# EAGLE design 16s balancer 3 (EAGLE 7.7.0)
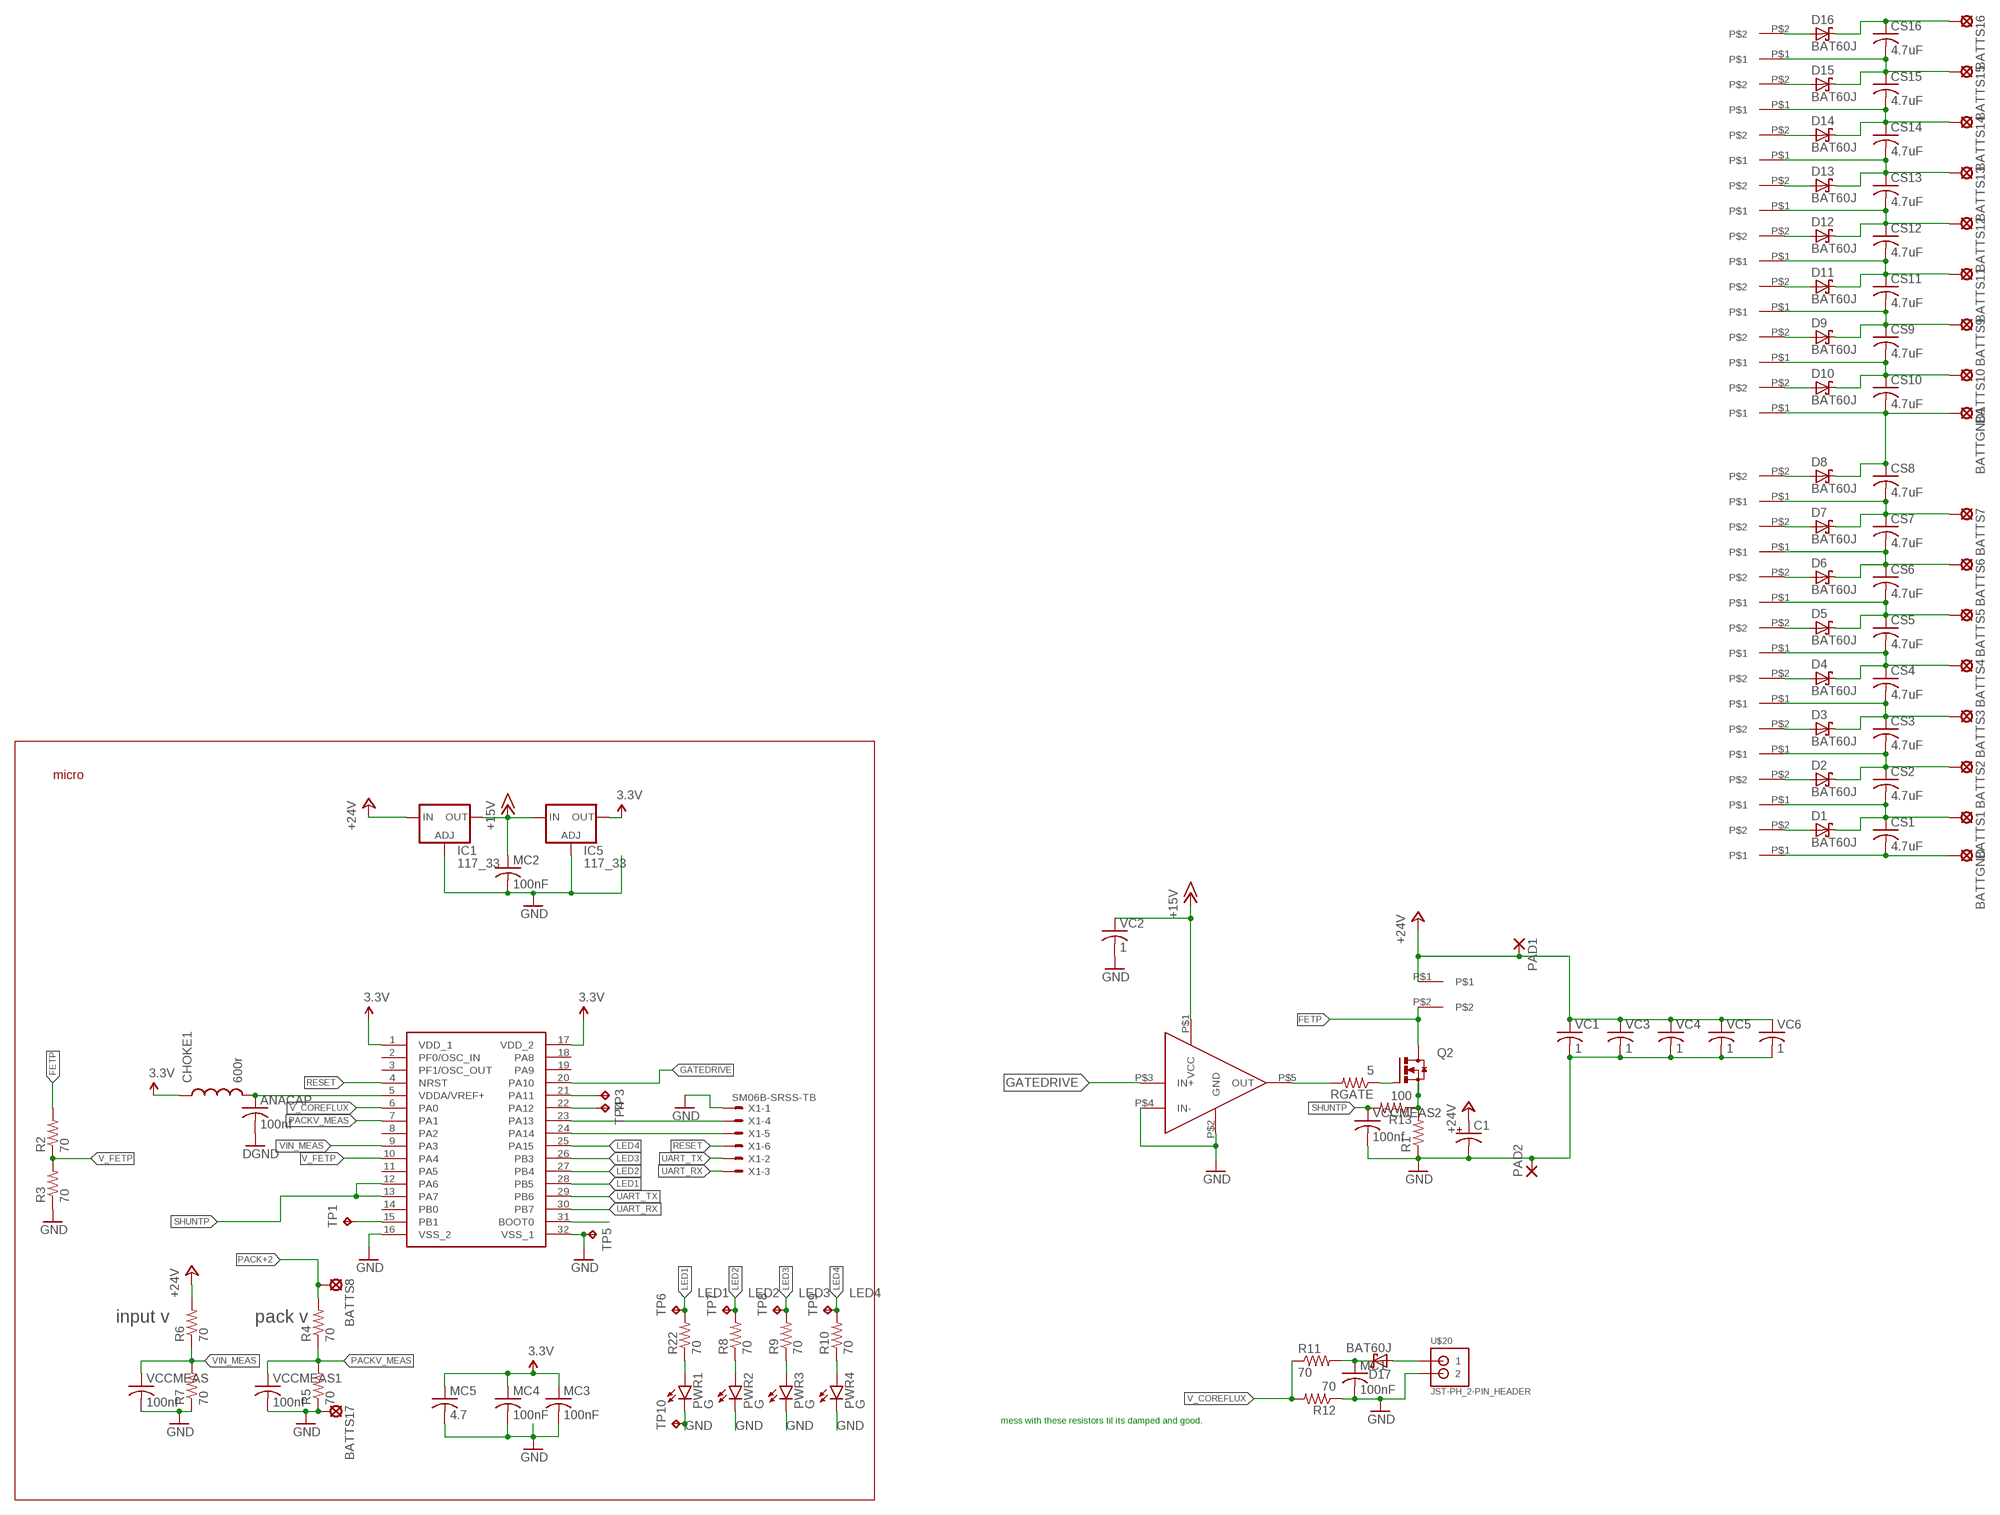
[diagram p0: schematic, sheet 1]

## Parts
ANACAP  100nf  C-USC0603  [C0603]
BATTGND  LSP10  [LSP10]
BATTGND1  LSP10  [LSP10]
BATTS1  LSP10  [LSP10]
BATTS2  LSP10  [LSP10]
BATTS3  LSP10  [LSP10]
BATTS4  LSP10  [LSP10]
BATTS5  LSP10  [LSP10]
BATTS6  LSP10  [LSP10]
BATTS7  LSP10  [LSP10]
BATTS8  LSP10  [LSP10]
BATTS9  LSP10  [LSP10]
BATTS10  LSP10  [LSP10]
BATTS11  LSP10  [LSP10]
BATTS12  LSP10  [LSP10]
BATTS13  LSP10  [LSP10]
BATTS14  LSP10  [LSP10]
BATTS15  LSP10  [LSP10]
BATTS16  LSP10  [LSP10]
BATTS17  LSP10  [LSP10]
C1  CPOL-USE2.5-7  [E2,5-7]
CHOKE1  600r  INDUCTOR0603  [0603]
CS1  4.7uF  C-USC1206  [C1206]
CS2  4.7uF  C-USC1206  [C1206]
CS3  4.7uF  C-USC1206  [C1206]
CS4  4.7uF  C-USC1206  [C1206]
CS5  4.7uF  C-USC1206  [C1206]
CS6  4.7uF  C-USC1206  [C1206]
CS7  4.7uF  C-USC1206  [C1206]
CS8  4.7uF  C-USC1206  [C1206]
CS9  4.7uF  C-USC1206  [C1206]
CS10  4.7uF  C-USC1206  [C1206]
CS11  4.7uF  C-USC1206  [C1206]
CS12  4.7uF  C-USC1206  [C1206]
CS13  4.7uF  C-USC1206  [C1206]
CS14  4.7uF  C-USC1206  [C1206]
CS15  4.7uF  C-USC1206  [C1206]
CS16  4.7uF  C-USC1206  [C1206]
D1  BAT60J  [SOD323_ST]
D2  BAT60J  [SOD323_ST]
D3  BAT60J  [SOD323_ST]
D4  BAT60J  [SOD323_ST]
D5  BAT60J  [SOD323_ST]
D6  BAT60J  [SOD323_ST]
D7  BAT60J  [SOD323_ST]
D8  BAT60J  [SOD323_ST]
D9  BAT60J  [SOD323_ST]
D10  BAT60J  [SOD323_ST]
D11  BAT60J  [SOD323_ST]
D12  BAT60J  [SOD323_ST]
D13  BAT60J  [SOD323_ST]
D14  BAT60J  [SOD323_ST]
D15  BAT60J  [SOD323_ST]
D16  BAT60J  [SOD323_ST]
D17  BAT60J  [SOD323_ST]
IC1  117_33  LD117AS33TR  [SOT223]
IC5  117_33  LD117AS33TR  [SOT223]
MC1  100nF  C-USC0603  [C0603]
MC2  100nF  C-USC0603  [C0603]
MC3  100nF  C-USC0603  [C0603]
MC4  100nF  C-USC0603  [C0603]
MC5  4.7  C-USC0603  [C0603]
PAD1  3,81/1,4  [3,81/1,4]
PAD2  3,81/1,4  [3,81/1,4]
PWR1  G  LED0603  [LED-0603]
PWR2  G  LED0603  [LED-0603]
PWR3  G  LED0603  [LED-0603]
PWR4  G  LED0603  [LED-0603]
Q2  PH7030L  [SOT669]
R1  R-US_R0805  [R0805]
R2  70  R-US_R0603  [R0603]
R3  70  R-US_R0603  [R0603]
R4  70  R-US_R0603  [R0603]
R5  70  R-US_R0603  [R0603]
R6  70  R-US_R0603  [R0603]
R7  70  R-US_R0603  [R0603]
R8  70  R-US_R0603  [R0603]
R9  70  R-US_R0603  [R0603]
R10  70  R-US_R0603  [R0603]
R11  70  R-US_R0603  [R0603]
R12  70  R-US_R0603  [R0603]
R13  100  R-US_R0603  [R0603]
R22  70  R-US_R0603  [R0603]
RGATE  5  R-US_R0603  [R0603]
TP1  TPTP10R  [TP10R]
TP3  TPTP10R  [TP10R]
TP4  TPTP10R  [TP10R]
TP5  TPTP10R  [TP10R]
TP6  TPTP14SQ  [TP14SQ]
TP7  TPTP14SQ  [TP14SQ]
TP8  TPTP14SQ  [TP14SQ]
TP9  TPTP14SQ  [TP14SQ]
TP10  TPTP14SQ  [TP14SQ]
U$1  STM32F303K8  [LQFP32-7X7]
U$2  UCC27517  [SOT-23-5]
U$3  LONG_PADS  [LONG_PADS2]
U$4  LONG_PADS  [LONG_PADS2]
U$5  LONG_PADS  [LONG_PADS2]
U$6  LONG_PADS  [LONG_PADS2]
U$7  LONG_PADS  [LONG_PADS2]
U$8  LONG_PADS  [LONG_PADS2]
U$9  LONG_PADS  [LONG_PADS2]
U$10  LONG_PADS  [LONG_PADS2]
U$11  LONG_PADS  [LONG_PADS2]
U$12  LONG_PADS  [LONG_PADS2]
U$13  LONG_PADS  [LONG_PADS2]
U$14  LONG_PADS  [LONG_PADS2]
U$15  LONG_PADS  [LONG_PADS2]
U$16  LONG_PADS  [LONG_PADS2]
U$17  LONG_PADS  [LONG_PADS2]
U$18  LONG_PADS  [LONG_PADS2]
U$19  LONG_PADS  [LONG_PADS2]
U$20  JST-PH_2-PIN_HEADER  [JST_B2B-PH_HEADER]
VC1  1  C-USC1206  [C1206]
VC2  1  C-USC0603  [C0603]
VC3  1  C-USC1206  [C1206]
VC4  1  C-USC1206  [C1206]
VC5  1  C-USC1206  [C1206]
VC6  1  C-USC1206  [C1206]
VCCMEAS  100nf  C-USC0603  [C0603]
VCCMEAS1  100nf  C-USC0603  [C0603]
VCCMEAS2  100nf  C-USC0603  [C0603]
X1  SM06B-SRSS-TB  [SM06B-SRSS-TB]

## Nets
3.3V: CHOKE1.1 IC5.4(OUT) MC3.1 MC4.1 MC5.1 U$1.1(VDD_1) U$1.17(VDD_2)
+15V: IC1.4(OUT) IC5.3(IN) MC2.1 U$2.P$1(VCC) VC2.1
+24V: C1.+ IC1.3(IN) PAD1.1(P) R6.2 U$3.P$1 VC1.1 VC3.1 VC4.1 VC5.1 VC6.1
CELL1: BATTS1.MP CS1.1 CS2.2 D1.C U$5.P$1
CELL2: BATTS2.MP CS2.1 CS3.2 D2.C U$6.P$1
CELL3: BATTS3.MP CS3.1 CS4.2 D3.C U$7.P$1
CELL4: BATTS4.MP CS4.1 CS5.2 D4.C U$8.P$1
CELL5: BATTS5.MP CS5.1 CS6.2 D5.C U$9.P$1
CELL6: BATTS6.MP CS6.1 CS7.2 D6.C U$10.P$1
CELL7: BATTS7.MP CS7.1 CS8.2 D7.C U$11.P$1
CELL8: BATTGND1.MP CS8.1 CS10.2 D8.C U$13.P$1
CELL9: BATTS10.MP CS9.2 CS10.1 D10.C U$12.P$1
CELL10: BATTS11.MP CS11.1 CS12.2 D11.C U$15.P$1
CELL11: BATTS9.MP CS9.1 CS11.2 D9.C U$14.P$1
CELL12: BATTS12.MP CS12.1 CS13.2 D12.C U$16.P$1
CELL13: BATTS14.MP CS14.1 CS15.2 D14.C U$18.P$1
CELL14: BATTS13.MP CS13.1 CS14.2 D13.C U$17.P$1
CELL16: BATTS15.MP CS15.1 CS16.2 D15.C U$19.P$1
FETP: Q2.MB(D) R2.2 U$3.P$2
GATEDRIVE: U$1.20(PA10) U$2.P$3(IN+)
GND: ANACAP.2 BATTS17.MP C1.- IC1.1(ADJ) IC5.1(ADJ) MC1.2 MC2.2 MC3.2 MC4.2 MC5.2 PAD2.1(P) PWR1.C PWR2.C PWR3.C PWR4.C R1.1 R3.1 R5.1 R7.1 R12.1 TP5.TP TP10.TP U$1.16(VSS_2) U$1.32(VSS_1) U$2.P$2(GND) U$2.P$4(IN-) U$20.P2 VC1.2 VC2.2 VC3.2 VC4.2 VC5.2 VC6.2 VCCMEAS1.2 VCCMEAS2.2 VCCMEAS.2 X1.1 ; supply symbol labelled DGND
LED1: R22.2 TP6.TP U$1.28(PB5)
LED2: R8.2 TP7.TP U$1.27(PB4)
LED3: R9.2 TP8.TP U$1.26(PB3)
LED4: R10.2 TP9.TP U$1.25(PA15)
N$1: D17.A U$20.P1
N$2: TP1.TP U$1.15(PB1)
N$3: D9.A U$12.P$2
N$4: D4.A U$7.P$2
N$5: D2.A U$5.P$2
N$6: D10.A U$13.P$2
N$7: D11.A U$14.P$2
N$8: D1.A U$4.P$2
N$9: D3.A U$6.P$2
N$10: D12.A U$15.P$2
N$11: D13.A U$16.P$2
N$12: D14.A U$17.P$2
N$13: D5.A U$8.P$2
N$14: D15.A U$18.P$2
N$15: D6.A U$9.P$2
N$16: D16.A U$19.P$2
N$17: D7.A U$10.P$2
N$18: U$1.31(BOOT0)
N$19: D8.A U$11.P$2
N$20: PWR2.A R8.1
N$21: Q2.4(G) RGATE.1
N$22: RGATE.2 U$2.P$5(OUT)
N$23: PWR3.A R9.1
N$24: PWR4.A R10.1
N$25: BATTGND.MP CS1.2 U$4.P$1
N$26: D17.C MC1.1 R11.2
N$28: PWR1.A R22.1
PACK+: BATTS16.MP CS16.1 D16.C
PACK+2: BATTS8.MP R4.2
PACKV_MEAS: R4.1 R5.2 U$1.7(PA1) VCCMEAS1.1
PROG1: U$1.23(PA13) X1.4
PROG2: U$1.24(PA14) X1.5
PWM1_N: TP3.TP U$1.21(PA11)
PWM2_N: TP4.TP U$1.22(PA12)
RESET: U$1.4(NRST) X1.6
SHUNTP: R13.2 U$1.12(PA6) U$1.13(PA7) VCCMEAS2.1
SHUNTP-NF: Q2.1(S) Q2.2(S) Q2.3(S) R1.2 R13.1
UART_RX: U$1.30(PB7) X1.3
UART_TX: U$1.29(PB6) X1.2
V_COREFLUX: R11.1 R12.2 U$1.6(PA0)
V_FETP: R2.1 R3.2 U$1.10(PA4)
VDDA: ANACAP.1 CHOKE1.2 U$1.5(VDDA/VREF+)
VIN_MEAS: R6.1 R7.2 U$1.9(PA3) VCCMEAS.1
Unconnected: U$1.2(PF0/OSC_IN) U$1.3(PF1/OSC_OUT) U$1.8(PA2) U$1.11(PA5) U$1.14(PB0) U$1.18(PA8) U$1.19(PA9)

## Notes on the sheet
- micro
- input v | pack v
- mess with these resistors til its damped and good.

## Library data of the parts
ANACAP CS1-CS16 MC1-MC5 VC1-VC6 VCCMEAS VCCMEAS1 VCCMEAS2 = rcl:C-US: CAPACITOR, American symbol
BATTGND BATTGND1 BATTS1-BATTS17 = solpad:LSP10: SOLDER PAD drill 1.0 mm, distributor Buerklin, 12H555
C1 = rcl:CPOL-US: POLARIZED CAPACITOR, American symbol
CHOKE1 = SparkFun-Passives:INDUCTOR: Inductors Basic Inductor/Choke - 0603 and 1206. Footprints are not proven and vary greatly between part numbers. INDUCTOR POWER 3.3UH 4.0A SMD 0.197" L x 0.197" W x 0.177" H (5.00mm x 5.00mm x 4.50mm)
D1-D17 = diode:BAT60J: Schottky barrier diode Source: www.st.com, BAT60J.pdf
IC1 IC5 = v-reg:LD117A?*: Low drop fixed and adjustable positive voltage regulators 1 A Source: http://www.st.com/stonline/products/literature/ds/7194/ld1117axx.pdf
PAD1 PAD2 = wirepad:3,81/1,4: THROUGH-HOLE PAD
PWR1-PWR4 = SparkFun-LED:LED: LEDs Standard schematic elements and footprints for 5mm, 3mm, 1206, and 0603 sized LEDs. 5mm - Spark Fun Electronics SKU : COM-00529 (and others)
Q2 = transistor-power:PH7030L: N-channel TrenchMOS (TM) logic level FET Source: http://www.nxp.com/acrobat_download/datasheets/PH7030L_4.pdf
R1-R13 R22 RGATE = rcl:R-US_: RESISTOR, American symbol
TP1 TP3-TP10 = testpad:TP: Test pad
U$1 = BenLibrary:STM32F303K8
U$2 = austinlib:UCC27517
U$3-U$19 = austinlib:LONG_PADS
U$20 = SRG:JST-PH_2-PIN_HEADER: 2-pin JST PH Shrouded Header, top entry P/N B2B-PH-K-S Mating connector PHR-2 Mating cable assembly: Sparkfun PRT-09914 <http://www.sparkfun.com/products/9914>
X1 = con-jst2:?M06B-SRSS-TB: Disconnectable Crimp style connector, 1.0mm pitch 6 contacts

## Board
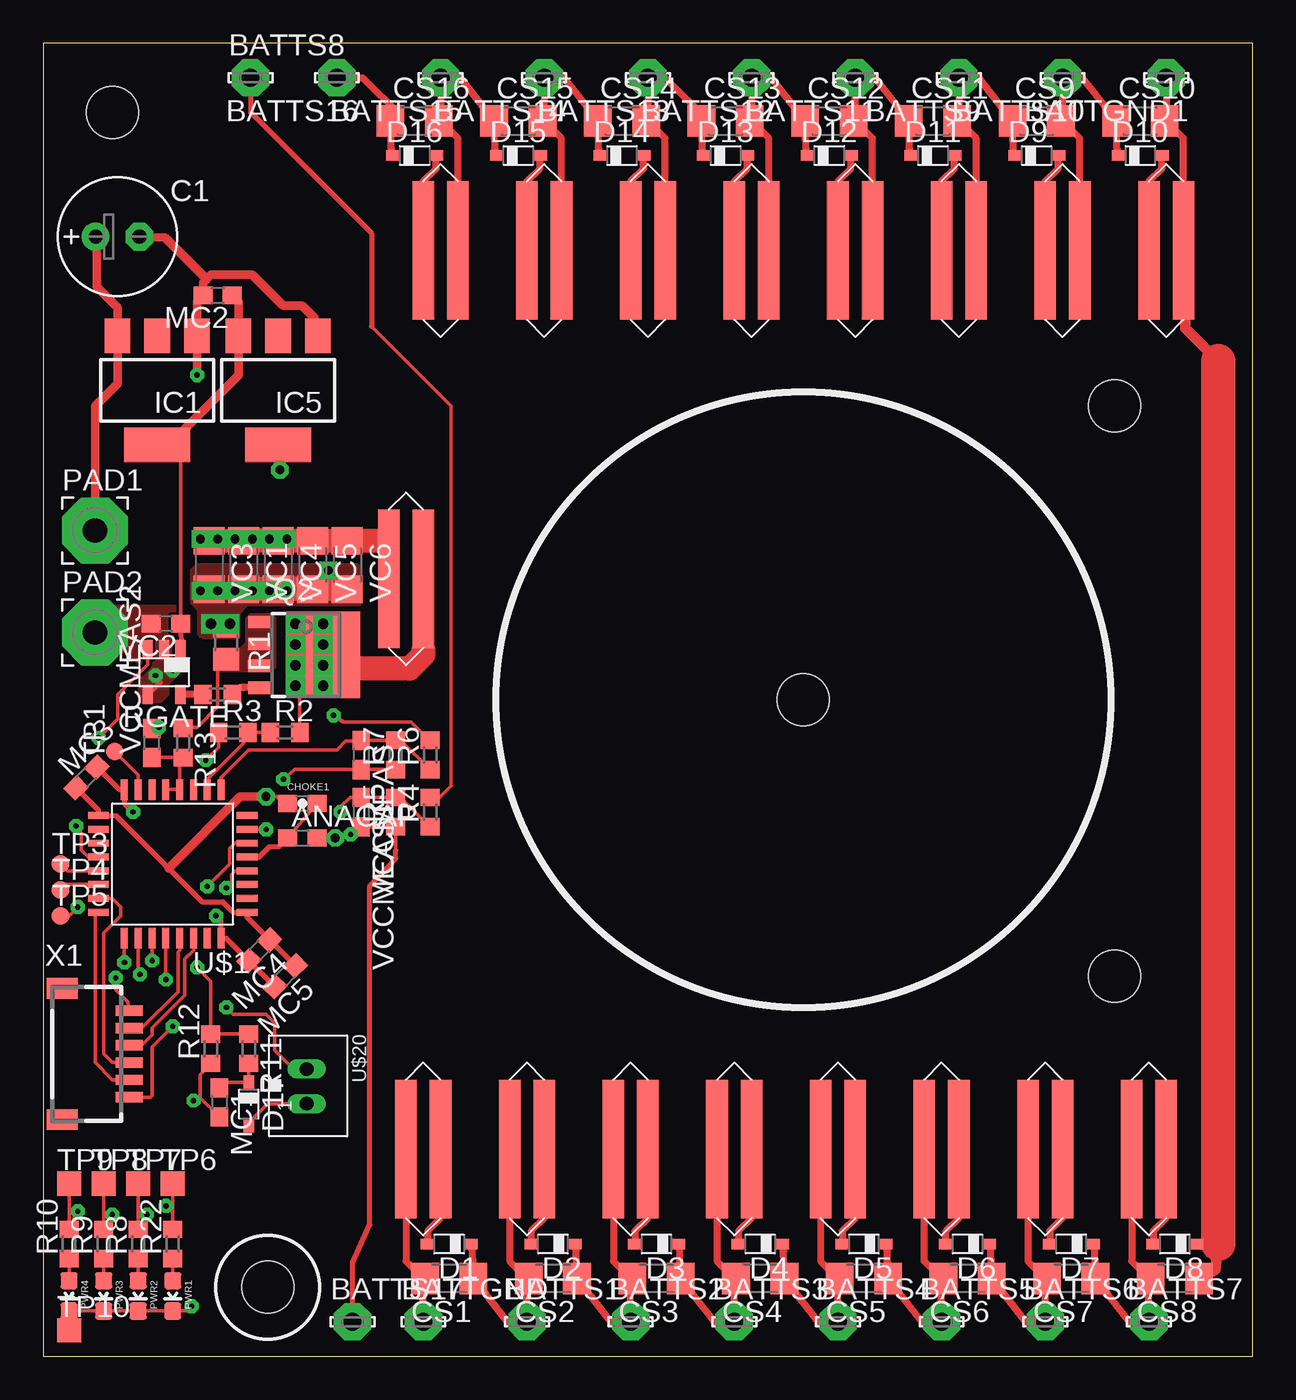
[diagram p1: board, top side]
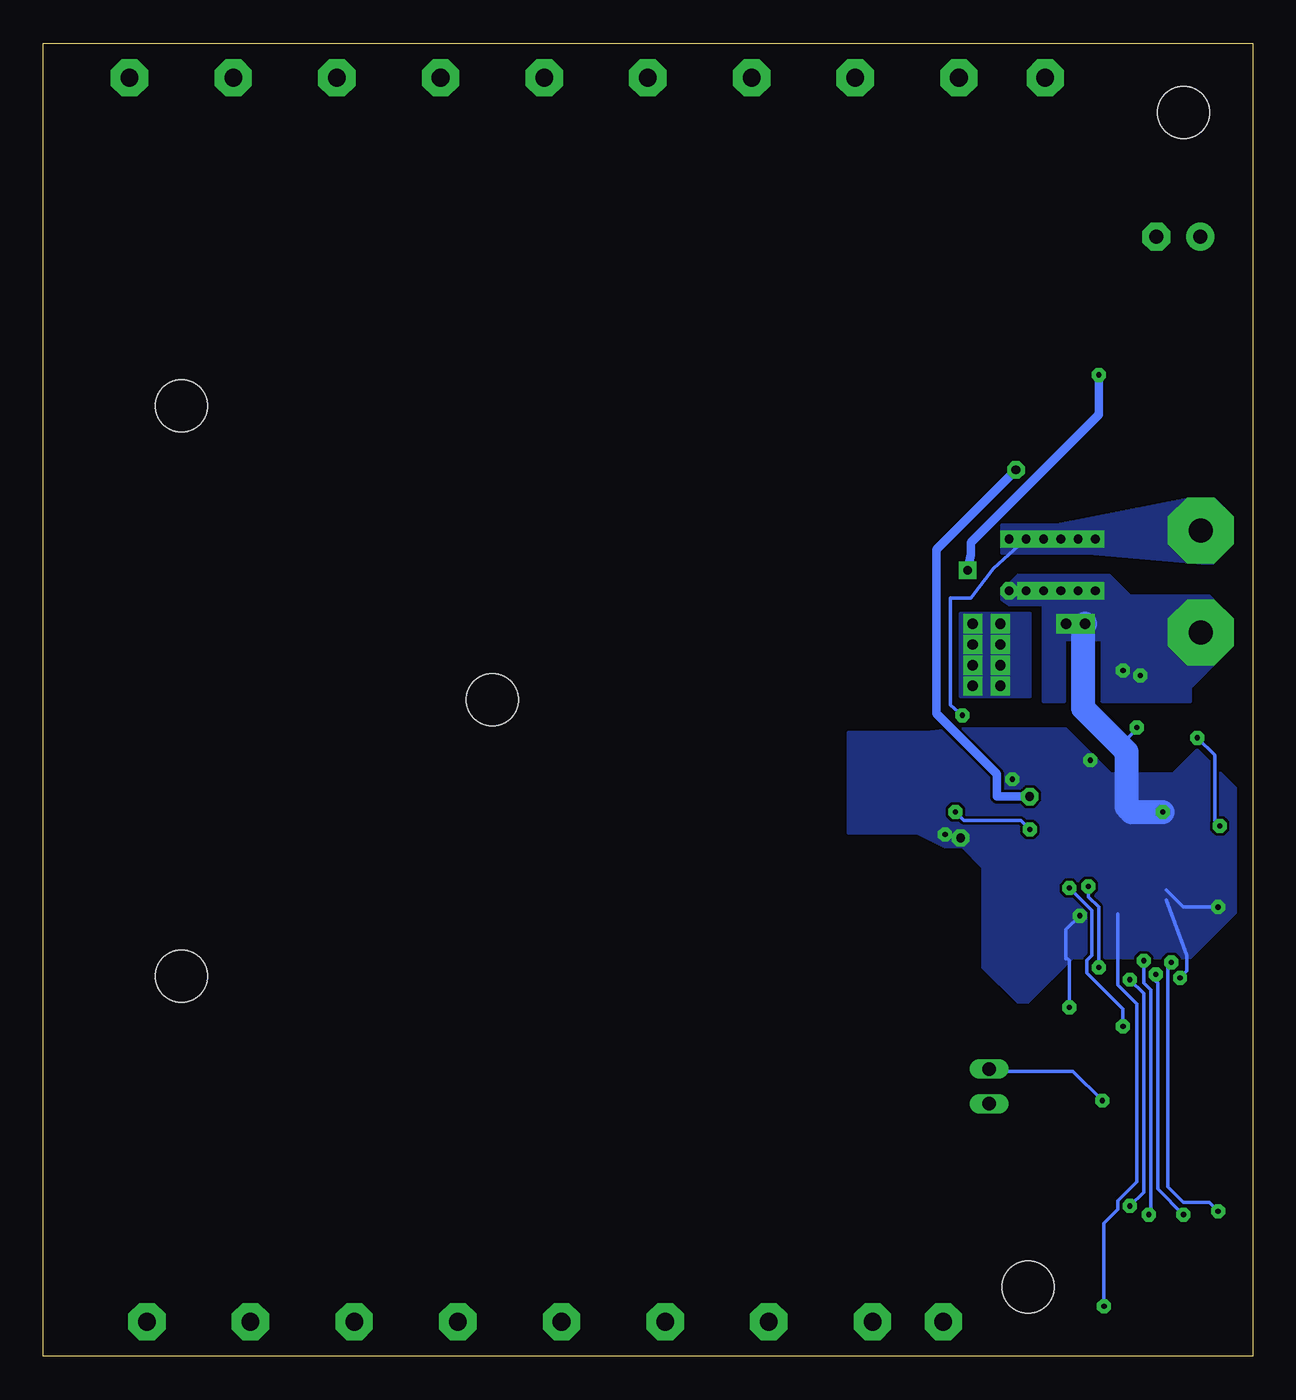
[diagram p2: board, bottom side, seen from below]

Size 70 x 76 mm. Coordinates in mm from the lower left corner, seen from the top.
Outline: 0,0 70,0 70,76 0,76 0,0
Copper layers (1*16): Top 0.035mm / dielectric 1.5mm / Bottom 0.035mm
Design rules "SparkFun-Amod3": minimum track width 6mil, minimum drill 11mil, track to track 6mil, track to pad 6mil, pad to pad 6mil, via to via 6mil, smd to smd 0mil, copper to edge 8mil, drill to drill 8mil, minimum pad ring 1mil, minimum via ring 10mil, stop-mask expansion 4mil, vias tented up to drill 20mil, thermal gap 10mil
Holes 3 mm at 13,4 44,38 4,72 62,55 62,22

### Footprints (pad centres in the part's own frame; a part is rotated, then mirrored left to right if it is on the bottom)
C0603 = smd 1.1 x 1: 1 -0.85,0; 2 0.85,0
LSP10 = drill 1.016 pad 2.159 octagon: MP 0,0
E2,5-7 = drill 0.813 pad 1.6: + -1.27,0 | drill 0.813 pad 1.6 octagon: - 1.27,0
0603 = smd 1.1 x 1: 1 -0.85,0; 2 0.85,0
C1206 = smd 1.6 x 1.8: 1 -1.4,0; 2 1.4,0
SOD323_ST = smd 0.8 x 0.6: A 1.25,0; C -1.25,0
SOT223 = smd 1.5 x 2: 1 -2.3,-3.15; 2 0,-3.15; 3 2.3,-3.15 | smd 3.8 x 2: 4 0,3.15
3,81/1,4 = drill 1.397 pad 3.81 octagon: 1 0,0
LED-0603 = smd 1 x 1: A 0,-0.877; C 0,0.877
SOT669 = smd 0.7 x 1.4: 1 -1.905,-2.65; 2 -0.635,-2.65; 3 0.635,-2.65; 4 1.905,-2.65 | smd 5 x 4.3: MB 0,1
R0805 = smd 1.3 x 1.5: 1 -0.95,0; 2 0.95,0
R0603 = smd 1 x 1.1: 1 -0.85,0; 2 0.85,0
TP10R = smd 1 x 1: TP 0,0
TP14SQ = smd 1.4 x 1.4: TP 0,0
LQFP32-7X7 = smd 1.2 x 0.4: 1 -4.3,2.8; 2 -4.3,2; 3 -4.3,1.2; 4 -4.3,0.4; 5 -4.3,-0.4; 6 -4.3,-1.2; 7 -4.3,-2; 8 -4.3,-2.8; 17 4.3,-2.8; 18 4.3,-2; 19 4.3,-1.2; 20 4.3,-0.4; 21 4.3,0.4; 22 4.3,1.2; 23 4.3,2; 24 4.3,2.8 | smd 0.4 x 1.2: 9 -2.8,-4.3; 10 -2,-4.3; 11 -1.2,-4.3; 12 -0.4,-4.3; 13 0.4,-4.3; 14 1.2,-4.3; 15 2,-4.3; 16 2.8,-4.3; 25 2.8,4.3; 26 2,4.3; 27 1.2,4.3; 28 0.4,4.3; 29 -0.4,4.3; 30 -1.2,4.3; 31 -2,4.3; 32 -2.8,4.3
SOT-23-5 = smd 1.1 x 0.6: P$1 -1.3,0.95; P$2 -1.3,0; P$3 -1.3,-0.95; P$4 1.3,-0.95; P$5 1.3,0.95
LONG_PADS2 = smd 8 x 1.25: P$1 0,-1; P$2 0,1
JST_B2B-PH_HEADER = drill 0.8 long: P1 1.075,0.048; P2 -0.925,0.048
SM06B-SRSS-TB = smd 0.6 x 1.55: 1 -2.5,2.975; 2 -1.5,2.975; 3 -0.5,2.975; 4 0.5,2.975; 5 1.5,2.975; 6 2.5,2.975 | smd 1.2 x 1.8: FIT@1 -3.8,-0.9; FIT@2 3.8,-0.9

### Placement (x,y rotation side)
ANACAP  15,30 0 top
BATTGND  22,2 0 top
BATTGND1  65,74 180 top
BATTS1  28,2 0 top
BATTS2  34,2 0 top
BATTS3  40,2 0 top
BATTS4  46,2 0 top
BATTS5  52,2 0 top
BATTS6  58,2 0 top
BATTS7  64,2 0 top
BATTS8  12,74 0 top
BATTS9  53,74 180 top
BATTS10  59,74 180 top
BATTS11  47,74 180 top
BATTS12  41,74 180 top
BATTS13  35,74 180 top
BATTS14  29,74 180 top
BATTS15  23,74 180 top
BATTS16  17,74 180 top
BATTS17  17.9,2 0 top
C1  4.3,64.8 0 top
CHOKE1  15,32 0 top
CS1  23.5,4.5 180 top
CS2  29.5,4.5 180 top
CS3  35.5,4.5 180 top
CS4  41.5,4.5 180 top
CS5  47.5,4.5 180 top
CS6  53.5,4.5 180 top
CS7  59.5,4.5 180 top
CS8  65.5,4.5 180 top
CS9  57.5,71.5 0 top
CS10  63.5,71.5 0 top
CS11  51.5,71.5 0 top
CS12  45.5,71.5 0 top
CS13  39.5,71.5 0 top
CS14  33.5,71.5 0 top
CS15  27.5,71.5 0 top
CS16  21.5,71.5 0 top
D1  23.5,6.5 180 top
D2  29.5,6.5 180 top
D3  35.5,6.5 180 top
D4  41.5,6.5 180 top
D5  47.5,6.5 180 top
D6  53.5,6.5 180 top
D7  59.5,6.5 180 top
D8  65.5,6.5 180 top
D9  57.5,69.5 0 top
D10  63.5,69.5 0 top
D11  51.5,69.5 0 top
D12  45.5,69.5 0 top
D13  39.5,69.5 0 top
D14  33.5,69.5 0 top
D15  27.5,69.5 0 top
D16  21.5,69.5 0 top
D17  11.9,14.6 270 top
IC1  6.6,55.9 180 top
IC5  13.6,55.9 180 top
MC1  10.2,14.7 270 top
MC2  10.1,61.4 180 top
MC3  2.5,33.5 45 top
MC4  12.5,23.5 225 top
MC5  14,22 225 top
PAD1  3,47.8 0 top
PAD2  3,41.9 0 top
PWR1  7.5,3.5 180 top
PWR2  5.5,3.5 180 top
PWR3  3.5,3.5 180 top
PWR4  1.5,3.5 180 top
Q2  15.2,40.6 270 top
R1  10.6,41.3 270 top
R2  14,36.1 0 top
R3  11,36.1 0 top
R4  22.4,31.5 90 top
R5  20.4,31.5 90 top
R6  22.4,34.8 90 top
R7  20.4,34.8 90 top
R8  5.5,6.5 90 top
R9  3.5,6.5 90 top
R10  1.5,6.5 90 top
R11  11.9,17.8 270 top
R12  9.7,17.8 90 top
R13  8.1,35.5 270 top
R22  7.5,6.5 90 top
RGATE  10.1,38.3 180 top
TP1  4.13,35.01 90 top
TP3  1,28.5 0 top
TP4  1,27 0 top
TP5  1,25.5 0 top
TP6  7.5,10 0 top
TP7  5.5,10 0 top
TP8  3.5,10 0 top
TP9  1.5,10 0 top
TP10  1.5,1.5 0 top
U$1  7.5,28.5 180 top
U$2  7,39.6 270 top
U$3  21,45 270 top
U$4  22,12 270 top
U$5  28,12 270 top
U$6  34,12 270 top
U$7  40,12 270 top
U$8  46,12 270 top
U$9  52,12 270 top
U$10  58,12 270 top
U$11  64,12 270 top
U$12  59,64 90 top
U$13  65,64 90 top
U$14  53,64 90 top
U$15  47,64 90 top
U$16  41,64 90 top
U$17  35,64 90 top
U$18  29,64 90 top
U$19  23,64 90 top
U$20  15.2,15.7 270 top
VC1  11.6,45.8 270 top
VC2  7.1,42.4 180 top
VC3  9.6,45.8 270 top
VC4  13.6,45.8 270 top
VC5  15.6,45.8 270 top
VC6  17.6,45.8 270 top
VCCMEAS  18.4,34.8 270 top
VCCMEAS1  18.4,31.5 270 top
VCCMEAS2  6.3,35.5 90 top
X1  2,17.5 270 top

### Tracks (layer width: path | path; a pad name or v marks a point on that pad's centre or on a via)
3.3V  (via drill 0.5)
  Top 0.2: CHOKE1.1 13.9,32 13.5,32.4 v12.9,32.4
  Top 0.3: MC3.1 3.2,31.6 U$1.17 4.2,31.3 7.25,28.25 9.2,26.3 10.4,26.3 11,25.7 U$1.1 11.8,25.4 MC4.1 MC5.1
  Top 0.5: v12.9,32.4 11.4,32.4 7.25,28.25 | v13.7,51.3 13.7,52.65 IC5.4
  Bottom 0.5: v12.9,32.4 14.8,32.4 14.8,33.7 18.3,37.2 18.3,46.7 v13.7,51.3
+15V
  Top 0.2: VC2.1 7.95,52 IC1.4
  Top 0.3: VC2.1 8,40.85 U$2.P$1
  Top 0.5: IC1.4 7.25,52.75 11.3,56.8 IC5.3 11.3,61.05 MC2.1
+24V  (via drill 0.3, 0.5)
  Top 0.2: U$3.P$1 20,46.9 19.8,47.1 | R6.2 22.35,35.65 21.3,36.7 17.4,36.7 v16.8,37.1
  Top 0.4: v11.1,47.3 11.5,47.3 VC1.1 | 11.7,47.2 11.9,47.2 12,47.3 v12.1,47.3 11.8,47.3 11.7,47.2
  Top 0.5: PAD1.1 3,55 4.3,56.3 IC1.3 4.3,60.7 3.1,61.9 3.1,63.73 C1.+
  Top 1.4: VC3.1 VC1.1 11.7,47.2 | v12.1,47.3 12.1,47.2 VC4.1 VC5.1 VC6.1 19.8,47.2 19.8,47.1
  Bottom 0.2: v16.8,37.1 17.5,37.7 17.5,43.9 16.3,43.9 15,45.6 13.2,47.2 v12.1,47.3
  other vias: 9.1,47.3 10.1,47.3 13.1,47.3 14.1,47.3
  pour Bottom (no thermals): 1.2,48.6 1.2,47 2.3,45.9 2.9,45.9 9.5,46.5 14.5,46.5 14.5,48.1 11.3,48.1 3.8,49.6 2.2,49.6
CELL1
  Top 0.4: U$5.P$1 27,5.5 28,4.5 | 28,4.5 BATTS1.MP 26.85,2 CS1.1 24.85,6.1 D1.C | 28,4.5 CS2.2
CELL2
  Top 0.4: 34,4.5 BATTS2.MP 32.85,2 CS2.1 30.85,6.1 D2.C | U$6.P$1 33,5.5 34,4.5 | CS3.2 34,4.5
CELL3
  Top 0.4: 40,4.5 BATTS3.MP 38.85,2 CS3.1 36.85,6.1 D3.C | U$7.P$1 39,5.5 40,4.5 | CS4.2 40,4.5
CELL4
  Top 0.4: 46,4.5 BATTS4.MP 44.85,2 CS4.1 42.85,6.1 D4.C | U$8.P$1 45,5.5 46,4.5 | CS5.2 46,4.5
CELL5
  Top 0.2: CS6.2 52,4.5
  Top 0.4: U$9.P$1 51,5.5 52,4.5 BATTS5.MP 50.85,2 CS5.1 48.85,6.1 D5.C
CELL6
  Top 0.4: 58,4.5 BATTS6.MP 56.85,2 CS6.1 54.85,6.1 D6.C | U$10.P$1 57,5.5 58,4.5 | 58,4.5 CS7.2
CELL7
  Top 0.4: U$11.P$1 63,5.5 64,4.5 | 64,4.5 CS8.2 | 64,4.5 BATTS7.MP 62.85,2 CS7.1 60.85,6.1 D7.C
CELL8
  Top 0.4: U$13.P$1 66,70.5 65,71.5 | 65,71.5 CS10.2 | BATTGND1.MP 65,71.5
  Top 0.6: 68,57.6 66.1,59.5 U$13.P$1 | D8.C 68,6.5 67.85,5 CS8.1
  Top 2: 68,6.5 68,57.6
CELL9
  Top 0.4: U$12.P$1 60,70.5 59,71.5 | 59,71.5 BATTS10.MP 60.15,74 CS10.1 62.15,69.9 D10.C | 59,71.5 CS9.2
CELL10
  Top 0.4: U$15.P$1 48,70.5 47,71.5 | 47,71.5 CS12.2 | D11.C 50.15,69.9 CS11.1 48.15,74 BATTS11.MP 47,71.5
CELL11
  Top 0.4: 53,71.5 BATTS9.MP 54.15,74 CS9.1 56.15,69.9 D9.C | U$14.P$1 54,70.5 53,71.5 | 53,71.5 CS11.2
CELL12
  Top 0.4: U$16.P$1 42,70.5 41,71.5 | 41,71.5 CS13.2 | 41,71.5 BATTS12.MP 42.15,74 CS12.1 44.15,69.9 D12.C
CELL13
  Top 0.4: U$18.P$1 30,70.5 29,71.5 | 29,71.5 CS15.2 | 29,71.5 BATTS14.MP 30.15,74 CS14.1 32.15,69.9 D14.C
CELL14
  Top 0.4: U$17.P$1 36,70.5 35,71.5 | 35,71.5 CS14.2 | 35,71.5 BATTS13.MP 36,74 38.5,71.5 CS13.1 38.15,69.9 D13.C
CELL16
  Top 0.4: U$19.P$1 24,70.5 23,71.5 | 23,71.5 CS16.2 | 23,71.5 BATTS15.MP 24.15,74 CS15.1 26.15,69.9 D15.C
FETP  (via drill 0.6)
  Top 0.2: U$3.P$2 22,40.9 | R2.2 14.85,38.35 16.65,40.15 16.35,40.15 v16.2,40
  Top 1.4: 22,40.9 22,40.6 21.2,39.8 17,39.8 16.65,40.15 Q2.MB
  other vias: 14.6,42.4 16.2,42.4 14.6,41.2 16.2,41.2 14.6,40 16.2,38.8 14.6,38.8
  pour Bottom: 14.2,43 16.9,43 16.9,38.2 12.9,38.2 12.9,43
GATEDRIVE  (via drill 0.3)
  Top 0.2: U$1.20 2.6,28.9 2.2,29.3 2.2,30.3 v1.9,30.7 | U$2.P$3 6.05,40.05 4.3,38.3 4.3,36.9 v3.2,35.8
  Bottom 0.2: v1.9,30.7 2.2,31 2.2,34.8 v3.2,35.8
GND  (via drill 0.3, 0.5, 0.6)
  Top 0.2: R7.1 VCCMEAS.2 14.55,33.95 v13.9,33.4 | 20.4,29.3 20.4,30.1 20.5,30.55 R5.1 VCCMEAS1.2 18.5,30.9 v17.8,30.2 | X1.1 4.9,20.5 4.2,21.2 v4.2,21.9 | v8.6,2.9 8.32,2.62 PWR1.C PWR2.C PWR3.C PWR4.C TP10.TP | v12.1,44.3 11.7,44.3 VC1.2 | v10.1,44.3 9.7,44.3 VC3.2 | R3.1 10.15,35.25 v9.4,34.5 | R12.1 9.7,16.9 9.1,16.3 9.1,14.95 | 9.1,14.95 MC1.2 | U$20.P2 14.47,16.62 13.4,17.7 13.4,19.3 12.9,19.8 11,19.8 v10.6,20.2 | 9.1,14.95 8.85,14.95 v8.7,14.8 | TP5.TP 1.5,25.5 v2,26 | VCCMEAS2.2 6.75,36.45 v6.7,36.4
  Top 0.3: 6.8,39 U$2.P$4 | MC3.2 4.4,32.8 U$1.16 4.7,32 v5.2,31.5 | MC5.2 MC4.2 10.6,24.2 U$1.32 10.3,25.2 v10,25.5 | ANACAP.2 v16.9,30 | BATTS17.MP 17.9,5.4 18.9,7.6 18.9,27.2 20.4,28.8 20.4,29.3
  Top 0.5: v10.8,42.4 11.05,42.25 R1.1 10.55,42.3 v9.7,42.4 | 9.45,62.35 9.25,62.15 MC2.2 8.9,61.05 IC1.1 v8.9,56.8 | 9.45,62.35 9.7,62.6 12.1,62.6 13.9,60.8 15,60.8 15.7,60.1 15.7,59.25 IC5.1 | C1.- 7.07,64.73 9.45,62.35
  Top 1.4: VC6.2 VC5.2 VC4.2 12.1,44.4 v12.1,44.3
  Bottom 0.2: v4.2,21.9 3.8,22.3 3.8,23.2 5,26.4 | v8.6,2.9 8.6,7.7 7.8,8.5 7.8,9 6.7,10.1 6.7,20.4 7.8,21.5 7.8,25.6 | v10.6,20.2 10.6,22.9 10.8,23.1 | 10.8,23.1 10.8,23 | 10.8,23.1 10.8,24.7 v10,25.5 | v8.7,14.8 10.4,16.5 14.57,16.5 14.7,16.62 U$20.P2 | v2,26 4,26 5,27 | v6.7,36.4 6.7,36.3 7.65,35.35
  Bottom 0.5: v8.9,56.8 8.9,54.5 16.3,47.1 16.3,46.4 v16.5,45.5
  Bottom 1.4: v9.7,42.4 9.8,42.3 9.8,37.5 7.65,35.35 7.3,35 7.3,31.8 7,31.5 v5.2,31.5
  other vias: 9.1,44.3 11.1,44.3 7.5,39.7 6.5,39.4 13.1,44.3 14.1,44.3
  pour Bottom (no thermals): 3.6,38.7 1.2,41.1 1.2,42.6 2.5,44 7.1,44 8.3,45.2 13.6,45.2 14.5,44.3 14.5,43.8 14.1,43.5 12.1,43.5 12.1,37.9 10.9,37.9 10.9,41.5 8.7,41.5 8.7,37.9 3.6,37.9
  pour Bottom: 3.2,35.1 4.6,33.7 8.2,33.7 10.8,36.3 17,36.3 18.9,36.1 23.4,36.1 23.4,30.3 19.4,30.3 17.8,29.5 16.8,29.5 15.6,28.3 15.6,22.5 13.6,20.5 13,20.5 10.4,23.1 3.6,23.1 1,25.7 1,32.9
  pour Bottom: 6.6,31.1 6.7,31 8.1,31
  pour Top (no thermals): 11.3,41.6 9.3,41.6 9.3,42.8 11.3,42.8
  pour Top (no thermals): 2.6,43.1 2.6,40.8 4.9,40.8 5.6,40.1 5.6,37.9 6.8,37.9 7.2,38.3 7.2,38.9 8.3,40 8.3,43 7.9,43.4 2.9,43.4
  pour Top (no thermals): 8.6,45.5 8.6,43.6 9,43.2 9,41.8 9.1,41.7 11.1,41.7 11.3,41.9 11.3,43 11.8,43.5 18.3,43.5 18.4,43.6 18.4,45.6 18.2,45.8 8.9,45.8
LED1  (via drill 0.3)
  Top 0.2: v7.1,8.7 7.5,8.3 R22.2 TP6.TP | v7.1,21.8 U$1.28
  Bottom 0.2: v7.1,8.7 6.3,9.5 6.3,21 v7.1,21.8
LED2  (via drill 0.3)
  Top 0.2: U$1.27 v6.3,22.9 | v6,8.2 R8.2 TP7.TP
  Bottom 0.2: v6.3,22.9 6.3,21.6 5.9,21.2 5.9,8.3 v6,8.2
LED3  (via drill 0.3)
  Top 0.2: U$1.26 5.5,22.3 5.6,22.2 v5.6,22.1 | v4,8.2 R9.2 TP8.TP
  Bottom 0.2: v5.6,22.1 5.6,21.7 5.5,21.6 5.5,9.7 v4,8.2
LED4  (via drill 0.3)
  Top 0.2: U$1.25 v4.7,22.8 | v2,8.4 R10.2 TP9.TP
  Bottom 0.2: v4.7,22.8 4.9,22.6 4.9,9.8 4,8.9 2.5,8.9 v2,8.4
N$1
  Top 0.2: D17.A 11.9,13.5 13,14.6 15.22,14.6 U$20.P1
N$2
  Top 0.2: U$1.15 5.5,33.64 TP1.TP
N$3
  Top 0.4: U$12.P$2 58,68 58.75,68.75 D9.A
N$4
  Top 0.4: U$7.P$2 41,8 40.25,7.25 D4.A
N$5
  Top 0.4: U$5.P$2 29,8 28.25,7.25 D2.A
N$6
  Top 0.4: U$13.P$2 64,68 64.75,68.75 D10.A
N$7
  Top 0.4: U$14.P$2 52,68 52.75,68.75 D11.A
N$8
  Top 0.4: U$4.P$2 23,8 22.25,7.25 D1.A
N$9
  Top 0.4: U$6.P$2 35,8 34.25,7.25 D3.A
N$10
  Top 0.4: U$15.P$2 46,68 46.75,68.75 D12.A
N$11
  Top 0.4: U$16.P$2 40,68 40.75,68.75 D13.A
N$12
  Top 0.4: U$17.P$2 34,68 34.75,68.75 D14.A
N$13
  Top 0.4: U$8.P$2 47,8 46.25,7.25 D5.A
N$14
  Top 0.4: U$18.P$2 28,68 28.75,68.75 D15.A
N$15
  Top 0.4: U$9.P$2 53,8 52.25,7.25 D6.A
N$16
  Top 0.4: U$19.P$2 22,68 22.75,68.75 D16.A
N$17
  Top 0.4: U$10.P$2 59,8 58.25,7.25 D7.A
N$19
  Top 0.4: U$11.P$2 65,8 64.25,7.25 D8.A
N$20
  Top 0.2: PWR2.A R8.1
N$21
  Top 0.4: Q2.4 11.6,38.7 11.35,38.7 RGATE.1
N$22
  Top 0.4: RGATE.2 U$2.P$5
N$23
  Top 0.2: PWR3.A R9.1
N$24
  Top 0.2: PWR4.A R10.1
N$25
  Top 0.4: U$4.P$1 21,5.5 22,4.5 | 22,4.5 CS1.2 | BATTGND.MP 22,4.5
N$26
  Top 0.2: MC1.1 10.5,15.85 D17.C R11.2
N$28
  Top 0.2: PWR1.A R22.1
PACK+
  Top 0.4: BATTS16.MP 18.5,74 20.65,71.85 CS16.1 20.15,69.9 D16.C
PACK+2
  Top 0.2: R4.2 22.95,32.35 23.6,33 23.6,55 19,59.6
  Top 0.3: BATTS8.MP 12,72 19,65 19,59.6
PACKV_MEAS  (via drill 0.3)
  Top 0.2: R4.1 20.7,32.35 R5.2 VCCMEAS1.1 17.75,32.35 17.2,31.8 v17.2,31.5 | v12.9,30.5 U$1.7
  Bottom 0.2: v17.2,31.5 16.7,31 13.4,31 v12.9,30.5
PROG1
  Top 0.2: X1.4 4,17 3.5,17.5 3.5,24.5 4.5,25.5 4.5,26 4,26.5 U$1.23
PROG2
  Top 0.2: X1.5 4,16 3,17 3,25.5 U$1.24
PWM1_N
  Top 0.2: U$1.21 1.4,28.1 TP3.TP
PWM2_N
  Top 0.2: U$1.22 1.3,27.3 TP4.TP
RESET  (via drill 0.3)
  Top 0.2: U$1.4 11.1,28.1 10.9,27.9 10.9,27.4 v10.6,27.1 | v7.5,19.1 6.3,17.9 6.3,15.1 6.2,15 X1.6
  Bottom 0.2: v10.6,27.1 9.3,25.8 9.3,23.2 9.6,22.9 9.6,22.2 7.5,20.1 v7.5,19.1
SHUNTP
  Top 0.2: U$1.13 U$1.12 7.9,34.45 R13.2 VCCMEAS2.1
SHUNTP-NF
  Top 0.2: R1.2 10.1,39.85 10.1,37.6 8.9,36.4 8.15,36.4 R13.1
  pour Top (no thermals): 10,40.9 11.4,40.9 11.8,41.3 11.8,42.7 12,42.9 13.2,42.9 13.4,42.7 13.4,39.9 13.2,39.7 10,39.7
UART_RX
  Top 0.2: X1.3 5.7,18 6.3,18.6 6.3,19 8.2,20.9 8.2,23 8.7,23.5 U$1.30
UART_TX
  Top 0.2: X1.2 5.7,19 7.8,21.1 7.8,23.4 7.9,23.5 U$1.29
V_COREFLUX  (via drill 0.3)
  Top 0.2: U$1.6 11.1,29.7 10.8,29.4 10.8,28.5 v9.5,27.2 | v8.9,22.5 9.7,21.7 R12.2 R11.1
  Bottom 0.2: v9.5,27.2 9.5,26.6 8.9,26 v8.9,22.5
V_FETP
  Top 0.2: U$1.10 9.5,33.4 11.6,35.5 11.6,35.85 R3.2 R2.1
VDDA
  Top 0.2: ANACAP.1 CHOKE1.2
  Top 0.3: U$1.5 12.5,28.9 13.1,29.5 13.65,29.5 ANACAP.1
VIN_MEAS
  Top 0.2: 18.25,35.5 VCCMEAS.1 | VCCMEAS.1 R7.2 20.7,35.65 R6.1 | U$1.9 10.3,33.5 11.9,35.1 17,35.1 17.5,35.6 18.35,35.6 VCCMEAS.1